# Altium project Four-Axis.PrjPcb
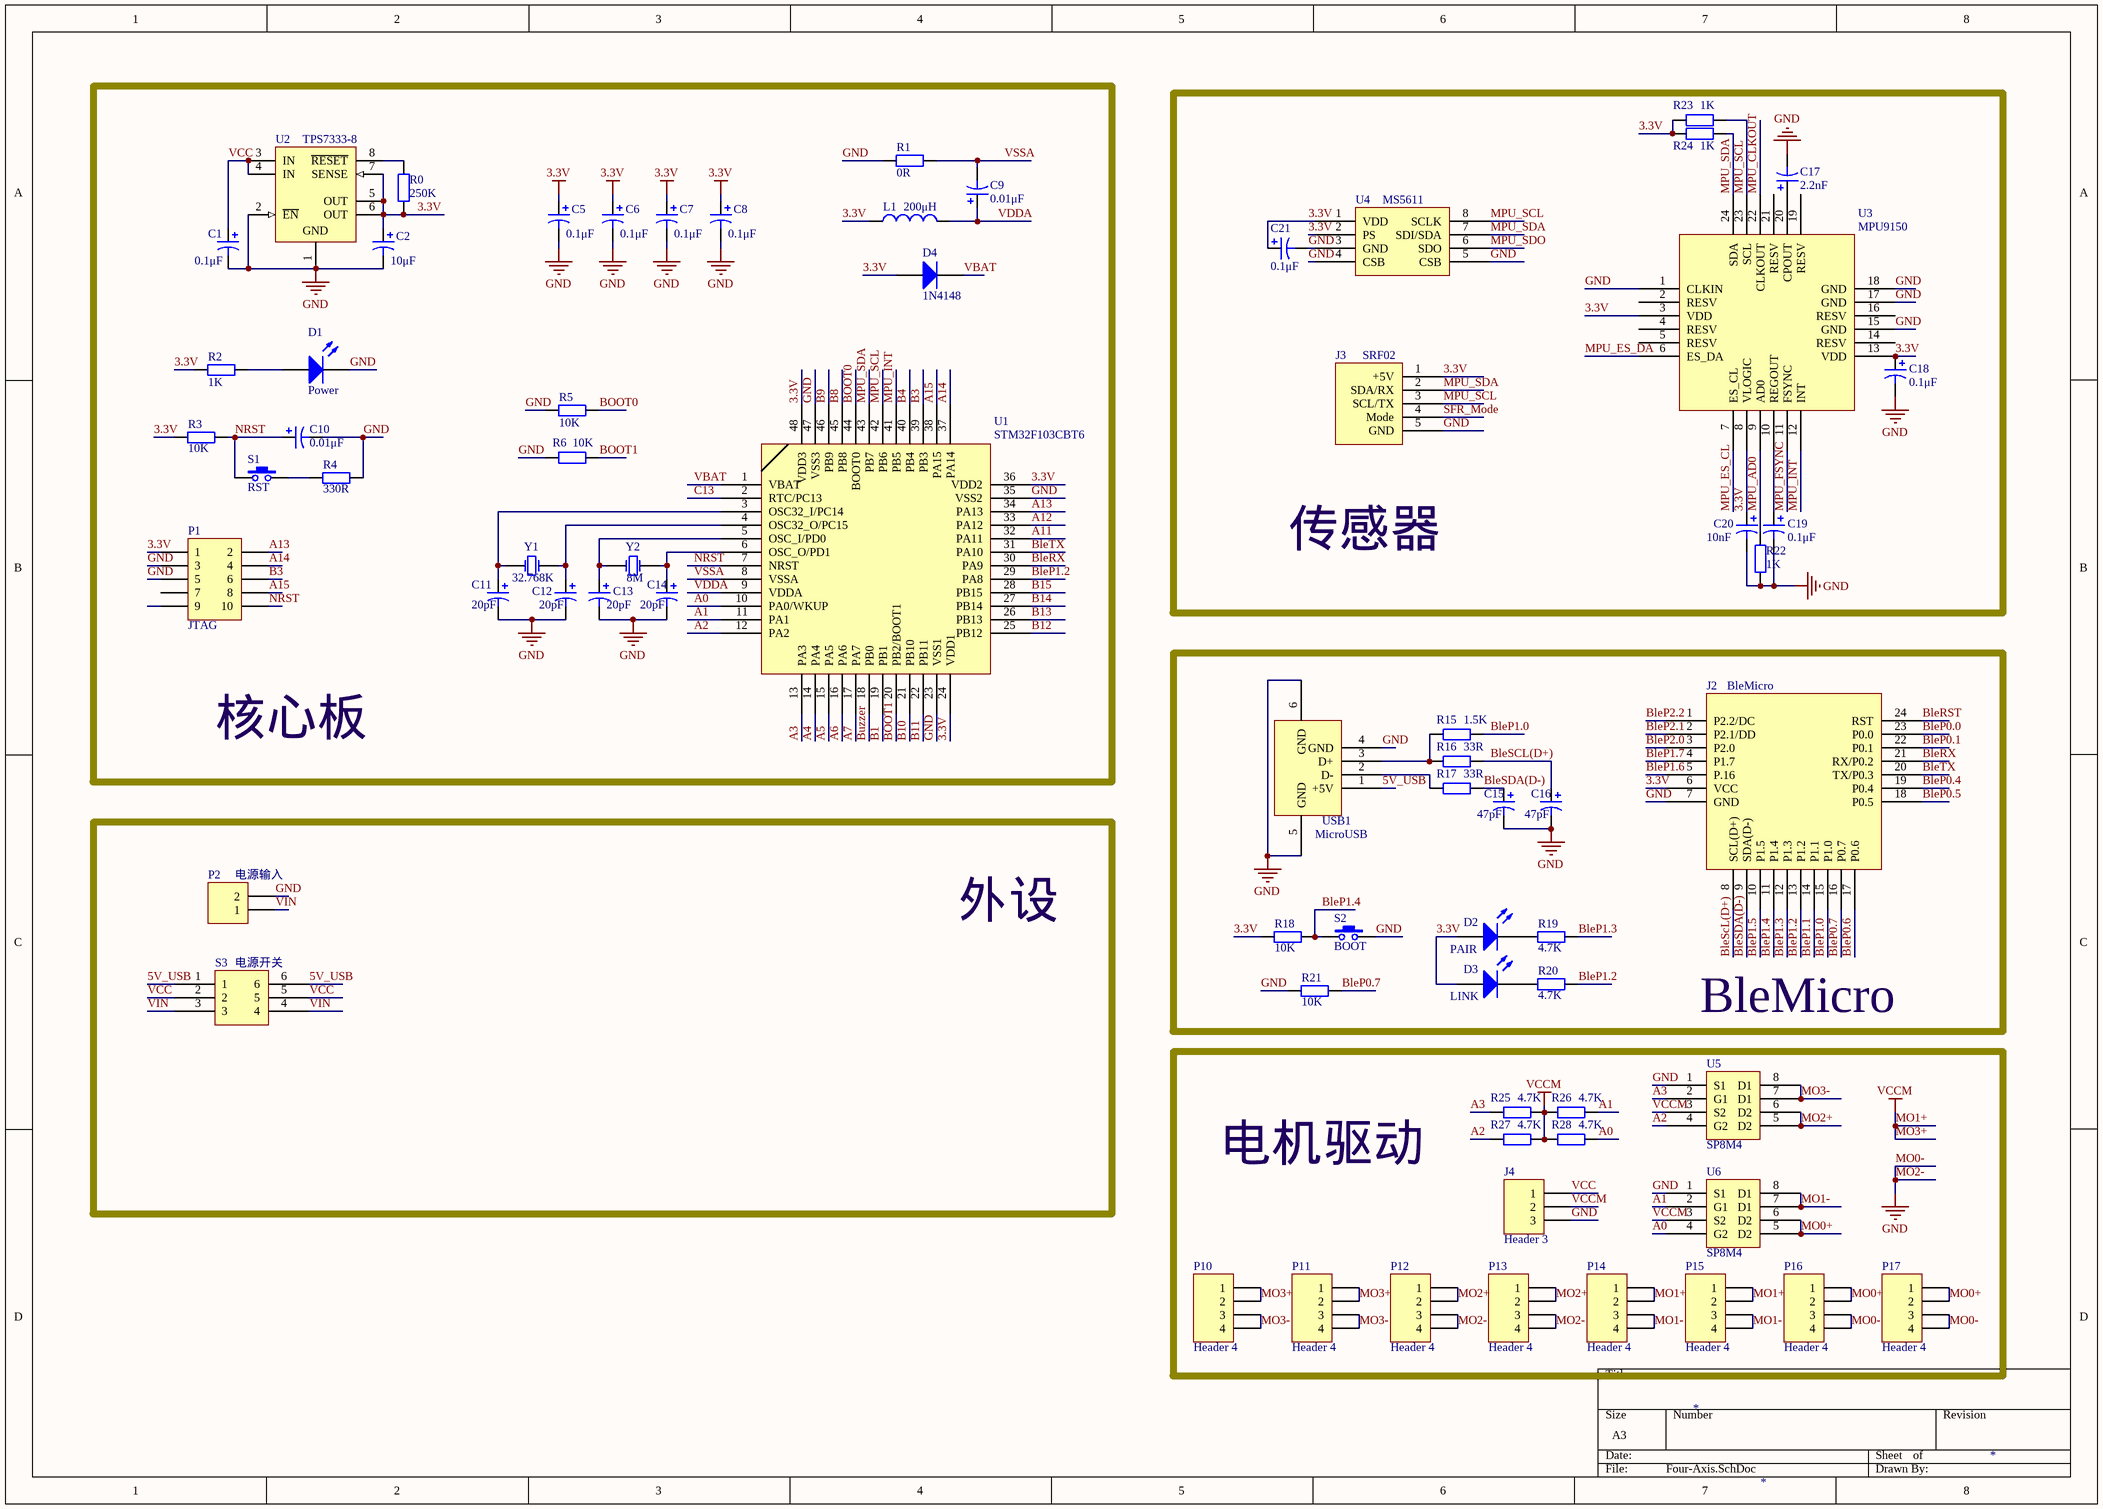
[diagram p0: Four-Axis.SchDoc]
1 sheet, 70 parts. Net scope: global (net labels, ports and power ports of the same name join across sheets).
Board file: Four-Axis.PcbDoc

## Sheet Four-Axis.SchDoc
size A3

### Parts
C1  value 0.1μF  [0603R]  (hidden comment: Cap Pol3)
C2  value 10μF  [0603R]  (hidden comment: Cap Pol3)
C5  value 0.1μF  [0603R]  (hidden comment: Cap Pol3)
C6  value 0.1μF  [0603R]  (hidden comment: Cap Pol3)
C7  value 0.1μF  [0603R]  (hidden comment: Cap Pol3)
C8  value 0.1μF  [0603R]  (hidden comment: Cap Pol3)
C9  value 0.01μF  [0603R]  (hidden comment: Cap Pol3)
C10  value 0.01μF  [0603R]  (hidden comment: Cap Pol3)
C11  value 20pF  [0603R]  (hidden comment: Cap Pol3)
C12  value 20pF  [0603R]  (hidden comment: Cap Pol3)
C13  value 20pF  [0603R]  (hidden comment: Cap Pol3)
C14  value 20pF  [0603R]  (hidden comment: Cap Pol3)
C15  value 47pF  [0603R]  (hidden comment: Cap Pol3)
C16  value 47pF  [0603R]  (hidden comment: Cap Pol3)
C17  value 2.2nF  [0603R]  (hidden comment: Cap Pol3)
C18  value 0.1μF  [0603R]  (hidden comment: Cap Pol3)
C19  value 0.1μF  [0603R]  (hidden comment: Cap Pol3)
C20  value 10nF  [0603R]  (hidden comment: Cap Pol3)
C21  value 0.1μF  [0603R]  (hidden comment: Cap Pol3)
D1  Power  [0805D]
D2  PAIR  [0805D]
D3  LINK  [0805D]
D4  1N4148  [0805D]
J2  BleMicro  [BleMicro]
J3  SRF02  [HDR1X5]
J4  Header 3  [HDR1X3]
L1  value 200μH  [6-0805_N]  (hidden comment: Inductor)
P1  JTAG  [HDR2X5]
P2  电源输入  [HDR1X2]
P10  Header 4  [HDR1X4]
P11  Header 4  [HDR1X4]
P12  Header 4  [HDR1X4]
P13  Header 4  [HDR1X4]
P14  Header 4  [HDR1X4]
P15  Header 4  [HDR1X4]
P16  Header 4  [HDR1X4]
P17  Header 4  [HDR1X4]
R0  value 250K  [0603R]  (hidden comment: Res2)
R1  value 0R  [0603R]  (hidden comment: Res2)
R2  value 1K  [0603R]  (hidden comment: Res2)
R3  value 10K  [0603R]  (hidden comment: Res2)
R4  value 330R  [0603R]  (hidden comment: Res2)
R5  value 10K  [0603R]  (hidden comment: Res2)
R6  value 10K  [0603R]  (hidden comment: Res2)
R15  value 1.5K  [0603R]  (hidden comment: Res2)
R16  value 33R  [0603R]  (hidden comment: Res2)
R17  value 33R  [0603R]  (hidden comment: Res2)
R18  value 10K  [0603R]  (hidden comment: Res2)
R19  value 4.7K  [0603R]  (hidden comment: Res2)
R20  value 4.7K  [0603R]  (hidden comment: Res2)
R21  value 10K  [0603R]  (hidden comment: Res2)
R22  value 1K  [0603R]  (hidden comment: Res2)
R23  value 1K  [0603R]  (hidden comment: Res2)
R24  value 1K  [0603R]  (hidden comment: Res2)
R25  value 4.7K  [0603R]  (hidden comment: Res2)
R26  value 4.7K  [0603R]  (hidden comment: Res2)
R27  value 4.7K  [0603R]  (hidden comment: Res2)
R28  value 4.7K  [0603R]  (hidden comment: Res2)
S1  RST  [SW-SOT3*6]
S2  BOOT  [SW-SOT3*6]
S3  电源开关  [自锁开关-5.8*5.8]
U1  STM32F103CBT6  [LQFP48]
U2  TPS7333-8  [TPS73XX-8]
U3  MPU9150  [LCC24]
U4  MS5611  [LCC8]
U5  SP8M4  [TPS73XX-8]
U6  SP8M4  [TPS73XX-8]
USB1  MicroUSB  [MICROUSB_D2S6]
Y1  32.768K  [OSC_3X8d]
Y2  8M  [XTAL-HC49S]

### Blocks framed on the sheet
核心板: C1 C2 C5-C14 D1 D4 L1 P1 R0-R6 S1 U1 U2 Y1 Y2
传感器: C17-C21 J3 R22-R24 U3 U4
BleMicro: C15 C16 D2 D3 J2 R15-R21 S2 USB1
外设: P2 S3
电机驱动: J4 P10-P17 R25-R28 U5 U6

### Nets
3.3V: C2.1 C5.1 C6.1 C7.1 C8.1 C18.1 C20.1 C21.1 D2.1(A) D3.1(A) D4.1(A) J2.6(VCC) J3.1(+5V) L1.1 P1.1 R0.1 R2.1 R3.2 R18.2 R23.1 R24.1 U1.24(VDD1) U1.36(VDD2) U1.48(VDD3) U2.5(OUT) U2.6(OUT) U2.7(SENSE) U3.3(VDD) U3.8(VLOGIC) U3.13(VDD) U4.1(VDD) U4.2(PS)
GND: C1.2 C2.2 C5.2 C6.2 C7.2 C8.2 C10.2 C11.2 C12.2 C13.2 C14.2 C15.2 C16.2 C17.2 C18.2 C19.2 C20.2 C21.2 D1.2(K) J2.7(GND) J3.5(GND) J4.3 P1.3 P1.5 P2.2 P12.3 P12.4 P13.3 P13.4 P16.3 P16.4 P17.3 P17.4 R1.1 R4.1 R5.1 R6.1 R21.2 R22.2 S2.2 U1.23(VSS1) U1.35(VSS2) U1.47(VSS3) U2.1(GND) U2.2(~{EN}) U3.1(CLKIN) U3.15(GND) U3.17(GND) U3.18(GND) U4.3(GND) U4.4(CSB) U4.5(CSB) U5.1(S1) U6.1(S1) USB1.4(GND) USB1.5(GND) USB1.6(GND)  [also labelled MO0-, MO2-]
MO1+: J4.2 P10.1 P10.2 P11.1 P11.2 P14.1 P14.2 P15.1 P15.2 R25.2 R26.1 R27.2 R28.1 U5.3(S2) U6.3(S2)  [also labelled MO3+, VCCM]
5V_USB: S3.1 S3.6 USB1.1(+5V)
A0: R28.2 U1.10(PA0/WKUP) U6.4(G2)
A1: R26.2 U1.11(PA1) U6.2(G1)
A2: R27.1 U1.12(PA2) U5.4(G2)
A3: R25.1 U1.13(PA3) U5.2(G1)
A4: U1.14(PA4)
A5: U1.15(PA5)
A6: U1.16(PA6)
A7: U1.17(PA7)
A11: U1.32(PA11)
A12: U1.33(PA12)
A13: P1.2 U1.34(PA13)
A14: P1.4 U1.37(PA14)
A15: P1.8 U1.38(PA15)
B1: U1.19(PB1)
B3: P1.6 U1.39(PB3)
B4: U1.40(PB4)
B8: U1.45(PB8)
B9: U1.46(PB9)
B10: U1.21(PB10)
B11: U1.22(PB11)
B12: U1.25(PB12)
B13: U1.26(PB13)
B14: U1.27(PB14)
B15: U1.28(PB15)
BleP0.0: J2.23(P0.0)
BleP0.1: J2.22(P0.1)
BleP0.4: J2.19(P0.4)
BleP0.5: J2.18(P0.5)
BleP0.6: J2.17(P0.6)
BleP0.7: J2.16(P0.7) R21.1
BleP1.0: J2.15(P1.0) R15.2
BleP1.1: J2.14(P1.1)
BleP1.2: J2.13(P1.2) R20.1 U1.29(PA8)
BleP1.3: J2.12(P1.3) R19.1
BleP1.4: J2.11(P1.4) R18.1 S2.1
BleP1.5: J2.10(P1.5)
BleP1.6: J2.5(P.16)
BleP1.7: J2.4(P1.7)
BleP2.0: J2.3(P2.0)
BleP2.1: J2.2(P2.1/DD)
BleP2.2: J2.1(P2.2/DC)
BleRST: J2.24(RST)
BleRX: J2.21(RX/P0.2) U1.30(PA9)
BleSCL(D+): C16.1 J2.8(SCL(D+)) R16.2
BleSDA(D-): C15.1 J2.9(SDA(D-)) R17.2
BleTX: J2.20(TX/P0.3) U1.31(PA10)
BOOT0: R5.2 U1.44(BOOT0)
BOOT1: R6.2 U1.20(PB2/BOOT1)
Buzzer: U1.18(PB0)
C13: U1.2(RTC/PC13)
MO0+: P16.1 P16.2 P17.1 P17.2 U6.5(D2) U6.6(D2)
MO1-: P14.3 P14.4 P15.3 P15.4 U6.7(D1) U6.8(D1)
MO2+: P12.1 P12.2 P13.1 P13.2 U5.5(D2) U5.6(D2)
MO3-: P10.3 P10.4 P11.3 P11.4 U5.7(D1) U5.8(D1)
MPU_AD0: R22.1 U3.9(AD0)
MPU_CLKOUT: U3.22(CLKOUT)
MPU_ES_CL: U3.7(ES_CL)
MPU_ES_DA: U3.6(ES_DA)
MPU_FSYNC: U3.11(FSYNC)
MPU_INT: U1.41(PB5) U3.12(INT)
MPU_SCL: J3.3(SCL/TX) R23.2 U1.42(PB6) U3.23(SCL) U4.8(SCLK)
MPU_SDA: J3.2(SDA/RX) R24.2 U1.43(PB7) U3.24(SDA) U4.7(SDI/SDA)
MPU_SDO: U4.6(SDO)
NRST: C10.1 P1.10 R3.1 S1.1 U1.7(NRST)
SFR_Mode: J3.4(Mode)
VBAT: D4.2(K) U1.1(VBAT)
VCC: C1.1 J4.1 S3.2 S3.5 U2.3(IN) U2.4(IN)
VDDA: C9.1 L1.2 U1.9(VDDA)
VIN: P2.1 S3.3 S3.4
VSSA: C9.2 R1.2 U1.8(VSSA)
NetC11_1: C11.1 U1.3(OSC32_I/PC14) Y1.1(OSC1)
NetC12_1: C12.1 U1.4(OSC32_O/PC15) Y1.2(OSC2)
NetC13_1: C13.1 U1.5(OSC_I/PD0) Y2.1(OSC1)
NetC14_1: C14.1 U1.6(OSC_O/PD1) Y2.2(OSC2)
NetC17_1: C17.1 U3.20(CPOUT)
NetC19_1: C19.1 U3.10(REGOUT)
NetD1_1: D1.1(A) R2.2
NetD2_2: D2.2(K) R19.2
NetD3_2: D3.2(K) R20.2
NetR0_2: R0.2 U2.8(~{RESET})
NetR4_2: R4.2 S1.2
NetR15_1: R15.1 R16.1 USB1.3(D+)
NetR17_1: R17.1 USB1.2(D-)

Not connected (* = marked no-connect by the designer): P1 7 9; U3 2(RESV) 4(RESV) 5(RESV) 14(RESV) 16(RESV) 19(RESV) 21(RESV)

### Library data of the parts
C1 C2 C5-C21 = Cap Pol3: Polarized Capacitor (Surface Mount); Published: 8-Jun-2000; LatestRevisionDate: 29-May-2009; LatestRevisionNote: IPC-7351 Footprint Added.; PackageReference: C0805; Publisher: Altium Limited; PackageDescription: Chip Capacitor
D1-D3 = LED2: Typical RED, GREEN, YELLOW, AMBER GaAs LED; Published: 8-Jun-2000; LatestRevisionDate: 17-Jul-2002; LatestRevisionNote: Re-released for DXP Platform.; PackageVersion: Feb-2002; PackageReference: 3.2X1.6X1.1; Publisher: Altium Limited; PackageDescription: SM LED; 2 Flat Leads
D4 = Diode: Default Diode; Published: 8-Jun-2000; LatestRevisionDate: 17-Jul-2002; LatestRevisionNote: Re-released for DXP Platform.; PackageVersion: Sep-1996; PackageReference: SMC; Publisher: Altium Limited; PackageDescription: DO-214-AB/SMC; 2 C-Bend Leads; Body 7.9 x 5.9 mm, inc. leads (LxW); Code_JEDEC: DO-214-AB
J4 = Header 3: Header, 3-Pin; LatestRevisionDate: 17-Jul-2002; LatestRevisionNote: Re-released for DXP Platform.; Publisher: Altium Limited
L1 = Inductor: Code_IEC: 1005; Published: 8-Jun-2000; LatestRevisionDate: 29-May-2009; LatestRevisionNote: IPC-7351 Footprint Added.; PackageReference: 0402-A; Publisher: Altium Limited; PackageDescription: Chip Inductor; Code_JEITA: 0402
P1 = Header 5X2: Header, 5-Pin, Dual row; LatestRevisionDate: 17-Jul-2002; LatestRevisionNote: Re-released for DXP Platform.; Publisher: Altium Limited
P2 = Header 2: USART; LatestRevisionDate: 17-Jul-2002; LatestRevisionNote: Re-released for DXP Platform.; Publisher: Altium Limited
P10-P17 = Header 4: Header, 4-Pin; LatestRevisionDate: 17-Jul-2002; LatestRevisionNote: Re-released for DXP Platform.; Publisher: Altium Limited
R0-R6 R15-R28 = Res2: Resistor; Published: 8-Jun-2000; LatestRevisionDate: 17-Jul-2002; LatestRevisionNote: Re-released for DXP Platform.; PackageReference: AXIAL-0.4; Publisher: Altium Limited; PackageDescription: Axial Device, Thru-Hole; 2 Leads; 0.4 in Pin Spacing
S1 S2 = SW-PB: Switch; Published: 24-Mar-1999; LatestRevisionDate: 17-Jul-2002; LatestRevisionNote: Re-released for DXP Platform.; PackageReference: SPST-2; Publisher: Altium Limited
S3 = 自锁开关
U1 = STM32F103C8T6: LQFP48
U2 = TPS73XX-8
USB1 = USB
Y1 Y2 = J晶振-3